# Altium schematic sheet power_comm.SchDoc: =GlobalProjectName
size 209 x 297 mm; ApprovedBy: Утвердил; CheckedBy: Проверил; Author: Разработал; SheetNumber: 3; SheetTotal: 6; PageSetup: Record=PageOptions|CenterHorizontal=True|CenterVertical=True|PrintScale=1.00|XCorrection=1.00|YCorrection=1.00|PrintKind=1|BorderSize=5000000|LeftOffset=0|BottomOffset=0|Orientation=2|PaperLength=1000|PaperWidth=1000|Scale=100|PaperSource=15|PrintQuality=1200|MediaType=1|DitherType=10|PaperKind=A3|PrintScaleMode=1; Weight: -; ScaleFactor: -; NormInspection: Норм.Контр.
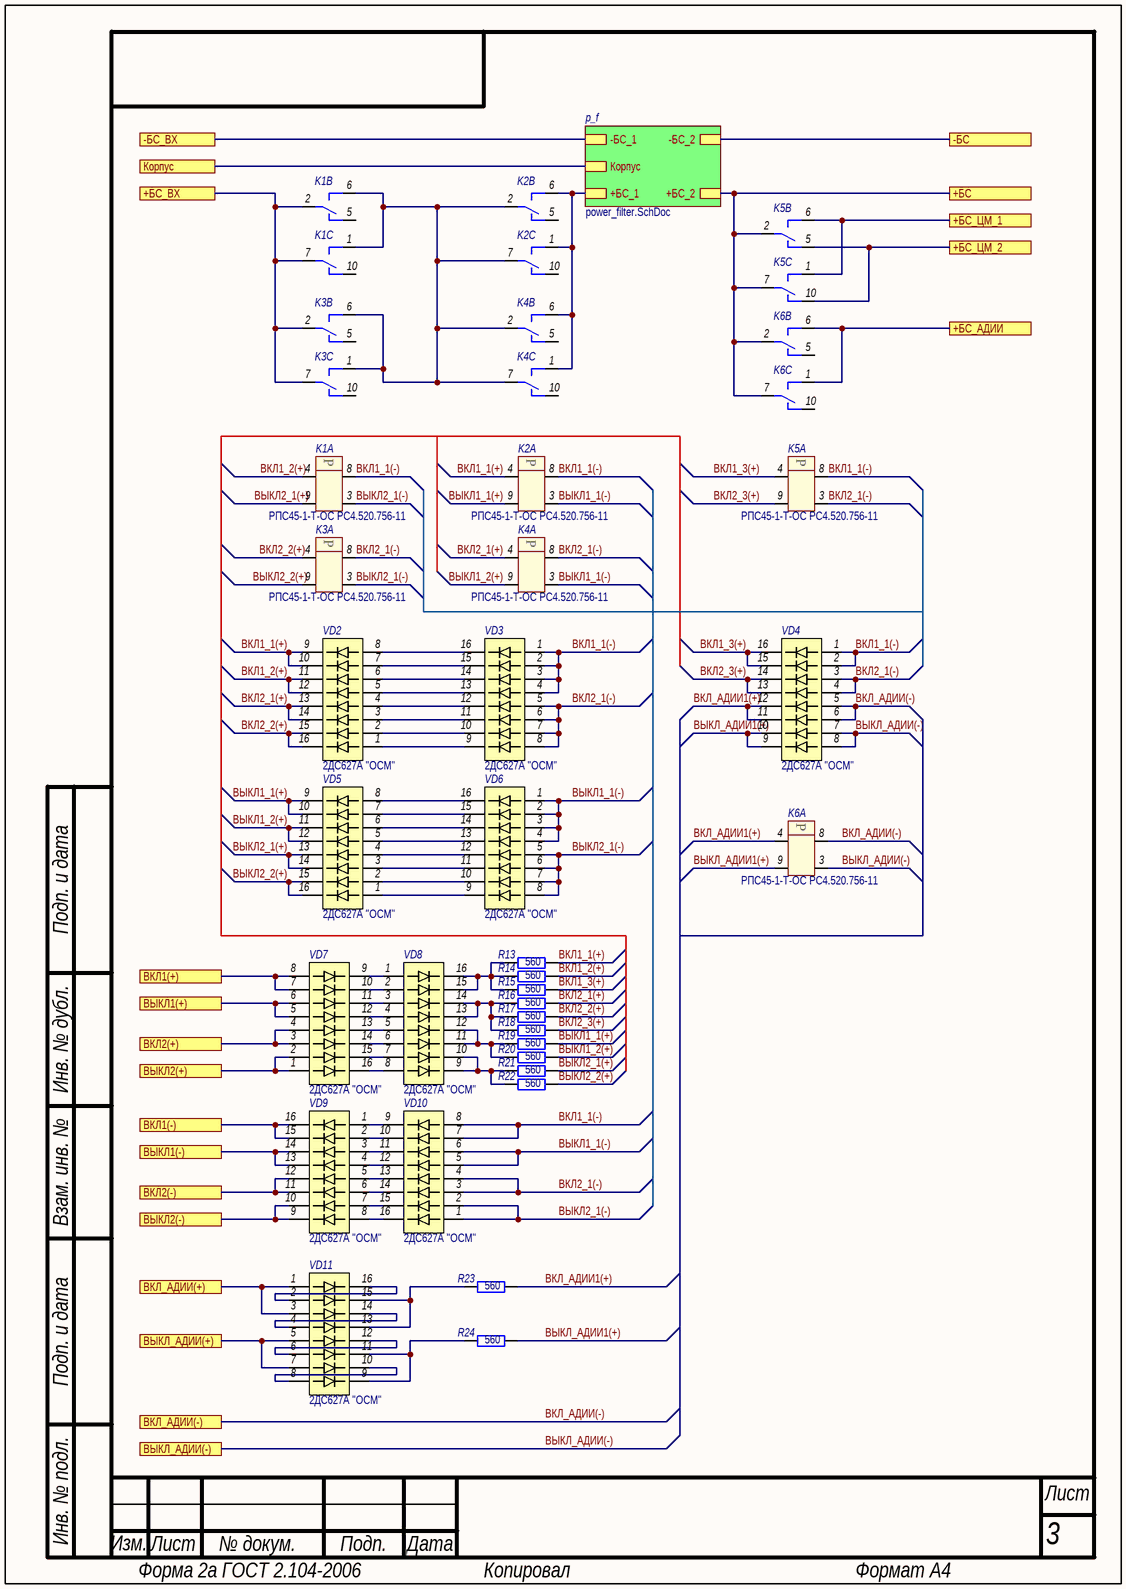
[diagram p0: power_comm.SchDoc]

## Parts
K1  Наименование: РПС45-1-Т-ОС РС4.520.756-11  [RPS-45-1]  (hidden comment: RPS45-1-T-OS)  (parts A,B,C of 3)
K2  Наименование: РПС45-1-Т-ОС РС4.520.756-11  [RPS-45-1]  (hidden comment: RPS45-1-T-OS)  (parts A,B,C of 3)
K3  Наименование: РПС45-1-Т-ОС РС4.520.756-11  [RPS-45-1]  (hidden comment: RPS45-1-T-OS)  (parts A,B,C of 3)
K4  Наименование: РПС45-1-Т-ОС РС4.520.756-11  [RPS-45-1]  (hidden comment: RPS45-1-T-OS)  (parts A,B,C of 3)
K5  Наименование: РПС45-1-Т-ОС РС4.520.756-11  [RPS-45-1]  (hidden comment: RPS45-1-T-OS)  (parts A,B,C of 3)
K6  Наименование: РПС45-1-Т-ОС РС4.520.756-11  [RPS-45-1]  (hidden comment: RPS45-1-T-OS)  (parts A,B,C of 3)
R13  560  [SMD_0805]
R14  560  [SMD_0805]
R15  560  [SMD_0805]
R16  560  [SMD_0805]
R17  560  [SMD_0805]
R18  560  [SMD_0805]
R19  560  [SMD_0805]
R20  560  [SMD_0805]
R21  560  [SMD_0805]
R22  560  [SMD_0805]
R23  560  [SMD_0805]
R24  560  [SMD_0805]
VD2  Наименование: 2ДС627А "ОСМ"  [401.16-3]  (hidden comment: 2DS627A OSM)
VD3  Наименование: 2ДС627А "ОСМ"  [401.16-3]  (hidden comment: 2DS627A OSM)
VD4  Наименование: 2ДС627А "ОСМ"  [401.16-3]  (hidden comment: 2DS627A OSM)
VD5  Наименование: 2ДС627А "ОСМ"  [401.16-3]  (hidden comment: 2DS627A OSM)
VD6  Наименование: 2ДС627А "ОСМ"  [401.16-3]  (hidden comment: 2DS627A OSM)
VD7  Наименование: 2ДС627А "ОСМ"  [401.16-3]  (hidden comment: 2DS627A OSM)
VD8  Наименование: 2ДС627А "ОСМ"  [401.16-3]  (hidden comment: 2DS627A OSM)
VD9  Наименование: 2ДС627А "ОСМ"  [401.16-3]  (hidden comment: 2DS627A OSM)
VD10  Наименование: 2ДС627А "ОСМ"  [401.16-3]  (hidden comment: 2DS627A OSM)
VD11  Наименование: 2ДС627А "ОСМ"  [401.16-3]  (hidden comment: 2DS627A OSM)

## Sub-sheets
p_f = power_filter.SchDoc: +БС_2, Корпус, -БС_2, +БС_1, -БС_1

## Ports
+БС, +БС_АДИИ, +БС_ВХ, +БС_ЦМ_1, +БС_ЦМ_2, -БС, -БС_ВХ, ВКЛ1(+), ВКЛ1(-), ВКЛ2(+), ВКЛ2(-), ВКЛ_АДИИ(+), ВКЛ_АДИИ(-), ВЫКЛ1(+), ВЫКЛ1(-), ВЫКЛ2(+), ВЫКЛ2(-), ВЫКЛ_АДИИ(+), ВЫКЛ_АДИИ(-), Корпус

## Nets
+БС: K5.2 K5.7 K6.2 K6.7 ; port +БС, sheet p_f/+БС_2
+БС_АДИИ: K6.1 K6.6 ; port +БС_АДИИ
+БС_ВХ: K1.2 K1.7 K3.2 K3.7 ; port +БС_ВХ
+БС_ЦМ_1: K5.1 K5.6 ; port +БС_ЦМ_1
+БС_ЦМ_2: K5.5 K5.10 ; port +БС_ЦМ_2
-БС: port -БС, sheet p_f/-БС_2
-БС_ВХ: port -БС_ВХ, sheet p_f/-БС_1
ВКЛ1(+): VD7.7(1G) VD7.8(1H) ; port ВКЛ1(+)
ВКЛ1(-): VD9.15(2B) VD9.16(2A) ; port ВКЛ1(-)
ВКЛ1_1(+): K2.4 R13.2 VD2.9(2G) VD2.10(2G)
ВКЛ1_1(-): K1.8 K2.8 K5.8 VD3.1(1A) VD3.2(1B) VD3.3(1C) VD3.4(1D) VD4.1(1A) VD4.2(1B) VD10.7(1G) VD10.8(1H)
ВКЛ1_2(+): K1.4 R14.2 VD2.11(2F) VD2.12(2E)
ВКЛ1_3(+): K5.4 R15.2 VD4.15(2B) VD4.16(2A)
ВКЛ2(+): VD7.3(1C) VD7.4(1D) ; port ВКЛ2(+)
ВКЛ2(-): VD9.11(2F) VD9.12(2E) ; port ВКЛ2(-)
ВКЛ2_1(+): K4.4 R16.2 VD2.13(2D) VD2.14(2C)
ВКЛ2_1(-): K3.8 K4.8 K5.3 VD3.5(1E) VD3.6(1F) VD3.7(1G) VD3.8(1H) VD4.3(1C) VD4.4(1D) VD10.3(1C) VD10.4(1D)
ВКЛ2_2(+): K3.4 R17.2 VD2.15(2B) VD2.16(2A)
ВКЛ2_3(+): K5.9 R18.2 VD4.13(2D) VD4.14(2C)
ВКЛ_АДИИ1(+): K6.4 R23.2 VD4.11(2F) VD4.12(2E)
ВКЛ_АДИИ(+): VD11.1(1A) VD11.3(1C) ; port ВКЛ_АДИИ(+)
ВКЛ_АДИИ(-): K6.8 VD4.5(1E) VD4.6(1F) ; port ВКЛ_АДИИ(-)
ВЫКЛ1(+): VD7.5(1E) VD7.6(1F) ; port ВЫКЛ1(+)
ВЫКЛ1(-): VD9.13(2D) VD9.14(2C) ; port ВЫКЛ1(-)
ВЫКЛ1_1(+): K2.9 R19.2 VD5.9(2G) VD5.10(2G)
ВЫКЛ1_1(-): K2.3 K4.3 VD6.1(1A) VD6.2(1B) VD6.3(1C) VD6.4(1D) VD10.5(1E) VD10.6(1F)
ВЫКЛ1_2(+): K4.9 R20.2 VD5.11(2F) VD5.12(2E)
ВЫКЛ2(+): VD7.1(1A) VD7.2(1B) ; port ВЫКЛ2(+)
ВЫКЛ2(-): VD9.9(2G) VD9.10(2G) ; port ВЫКЛ2(-)
ВЫКЛ2_1(+): K1.9 R21.2 VD5.13(2D) VD5.14(2C)
ВЫКЛ2_1(-): K1.3 K3.3 VD6.5(1E) VD6.6(1F) VD6.7(1G) VD6.8(1H) VD10.1(1A) VD10.2(1B)
ВЫКЛ2_2(+): K3.9 R22.2 VD5.15(2B) VD5.16(2A)
ВЫКЛ_АДИИ1(+): K6.9 R24.2 VD4.9(2G) VD4.10(2G)
ВЫКЛ_АДИИ(+): VD11.5(1E) VD11.7(1G) ; port ВЫКЛ_АДИИ(+)
ВЫКЛ_АДИИ(-): K6.3 VD4.7(1G) VD4.8(1H) ; port ВЫКЛ_АДИИ(-)
Корпус: port Корпус, sheet p_f/Корпус
NetK1_1: K1.1 K1.6 K2.2 K2.7 K3.1 K3.6 K4.2 K4.7
NetK2_1: K2.1 K2.6 K4.1 K4.6 ; sheet p_f/+БС_1
NetR13_1: R13.1 R14.1 R15.1 VD8.15(2B) VD8.16(2A)
NetR16_1: R16.1 R17.1 R18.1 VD8.13(2D) VD8.14(2C)
NetR19_1: R19.1 R20.1 VD8.11(2F) VD8.12(2E)
NetR21_1: R21.1 R22.1 VD8.9(2G) VD8.10(2G)
NetR23_1: R23.1 VD11.13(2D) VD11.15(2B)
NetR24_1: R24.1 VD11.9(2G) VD11.11(2F)
NetVD2_1: VD2.1(1A) VD3.9(2G)
NetVD2_2: VD2.2(1B) VD3.10(2G)
NetVD2_3: VD2.3(1C) VD3.11(2F)
NetVD2_4: VD2.4(1D) VD3.12(2E)
NetVD2_5: VD2.5(1E) VD3.13(2D)
NetVD2_6: VD2.6(1F) VD3.14(2C)
NetVD2_7: VD2.7(1G) VD3.15(2B)
NetVD2_8: VD2.8(1H) VD3.16(2A)
NetVD5_1: VD5.1(1A) VD6.9(2G)
NetVD5_2: VD5.2(1B) VD6.10(2G)
NetVD5_3: VD5.3(1C) VD6.11(2F)
NetVD5_4: VD5.4(1D) VD6.12(2E)
NetVD5_5: VD5.5(1E) VD6.13(2D)
NetVD5_6: VD5.6(1F) VD6.14(2C)
NetVD5_7: VD5.7(1G) VD6.15(2B)
NetVD5_8: VD5.8(1H) VD6.16(2A)
NetVD7_9: VD7.9(2G) VD8.1(1A)
NetVD7_10: VD7.10(2G) VD8.2(1B)
NetVD7_11: VD7.11(2F) VD8.3(1C)
NetVD7_12: VD7.12(2E) VD8.4(1D)
NetVD7_13: VD7.13(2D) VD8.5(1E)
NetVD7_14: VD7.14(2C) VD8.6(1F)
NetVD7_15: VD7.15(2B) VD8.7(1G)
NetVD7_16: VD7.16(2A) VD8.8(1H)
NetVD9_1: VD9.1(1A) VD10.9(2G)
NetVD9_2: VD9.2(1B) VD10.10(2G)
NetVD9_3: VD9.3(1C) VD10.11(2F)
NetVD9_4: VD9.4(1D) VD10.12(2E)
NetVD9_5: VD9.5(1E) VD10.13(2D)
NetVD9_6: VD9.6(1F) VD10.14(2C)
NetVD9_7: VD9.7(1G) VD10.15(2B)
NetVD9_8: VD9.8(1H) VD10.16(2A)
NetVD11_2: VD11.2(1B) VD11.16(2A)
NetVD11_4: VD11.4(1D) VD11.14(2C)
NetVD11_6: VD11.6(1F) VD11.12(2E)
NetVD11_8: VD11.8(1H) VD11.10(2G)

Not connected (* = marked no-connect by the designer): K1 5 10; K2 5 10; K3 5 10; K4 5 10; K6 5 10

## Notes on the sheet
- Подп. и дата
- Инв. № дубл.
- Взам. инв. №
- Инв. № подл.
- Изм.
- Лист
- № докум.
- Подп.
- Дата
- Форма 2а ГОСТ 2.104-2006
- Копировал
- Формат А4
- (in symbol RPS45, part A) P

## Library data of the parts
K1-K6 = RPS45: Реле поляризованное; Потребление, Вт: 0,000; Назначение: Реле поляризованное; ComponentLink1Description: DataSheet; ComponentLink1URL: https://relays.ru/files/catalog/rps45.pdf
R13-R24 = Resistor: Наименование: Резистор; Назначение: SMD-резистор; Потребление, Вт: 0,001; Value: 560
VD2-VD11 = 2DS627A: Диодная матрица; Потребление, Вт: 0,0; Назначение: Диодная матрица; ComponentLink1Description: DataSheet; ComponentLink1URL: https://www.integral.by/sites/default/files/pdf/2ds627a.pdf